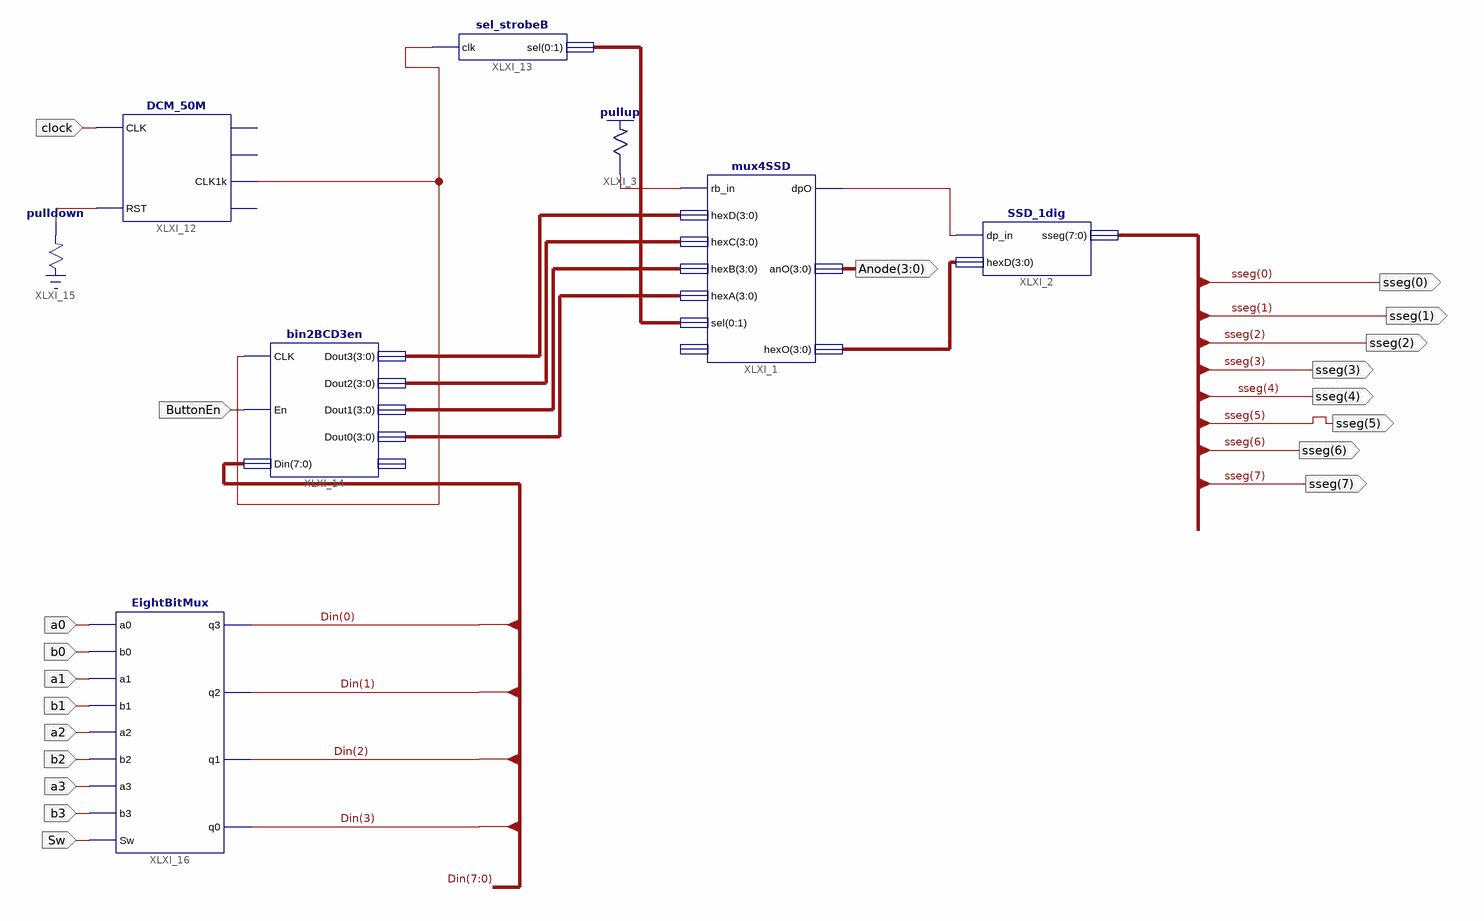
[diagram p0: schematic sheet 1]
// Xilinx ISE schematic Exp5.sch (spartan3e) as structural Verilog: 8 symbols, 20 ports
module Exp5 (
  input  ButtonEn,
  input  clock,
  input  a0,
  input  b0,
  input  a1,
  input  b1,
  input  a2,
  input  b2,
  input  a3,
  input  b3,
  input  Sw,
  output [7:0] sseg,
  output [3:0] Anode
);

  wire XLXN_5, XLXN_8, XLXN_33, XLXN_36;
  wire [1:0] XLXN_41;
  wire [3:0] XLXN_7, XLXN_37, XLXN_38, XLXN_39, XLXN_40;
  wire [7:0] Din;

  SSD_1dig XLXI_2 (.dp_in(XLXN_8), .hexD(XLXN_7), .sseg(sseg));
  \pullup  XLXI_3 (.O(XLXN_5));
  mux4SSD XLXI_1 (
    .rb_in(XLXN_5), .hexD(XLXN_37), .hexC(XLXN_38), .hexB(XLXN_39), .hexA(XLXN_40),
    .sel({XLXN_41[0], XLXN_41[1]}), .dpO(XLXN_8), .anO(Anode), .hexO(XLXN_7));  // open: dp_in
  DCM_50M XLXI_12 (.CLK(clock), .RST(XLXN_33), .CLK1k(XLXN_36));  // open: CLK1M, CLK10k, CLK1
  sel_strobeB XLXI_13 (.clk(XLXN_36), .sel({XLXN_41[0], XLXN_41[1]}));
  bin2BCD3en XLXI_14 (
    .CLK(XLXN_36), .En(ButtonEn), .Din(Din), .Dout3(XLXN_37), .Dout2(XLXN_38), .Dout1(XLXN_39),
    .Dout0(XLXN_40));  // open: RBout
  \pulldown  XLXI_15 (.O(XLXN_33));
  EightBitMux XLXI_16 (
    .a0(a0), .b0(b0), .a1(a1), .b1(b1), .a2(a2), .b2(b2), .a3(a3), .b3(b3), .Sw(Sw), .q3(Din[0]),
    .q2(Din[1]), .q1(Din[2]), .q0(Din[3]));
endmodule
